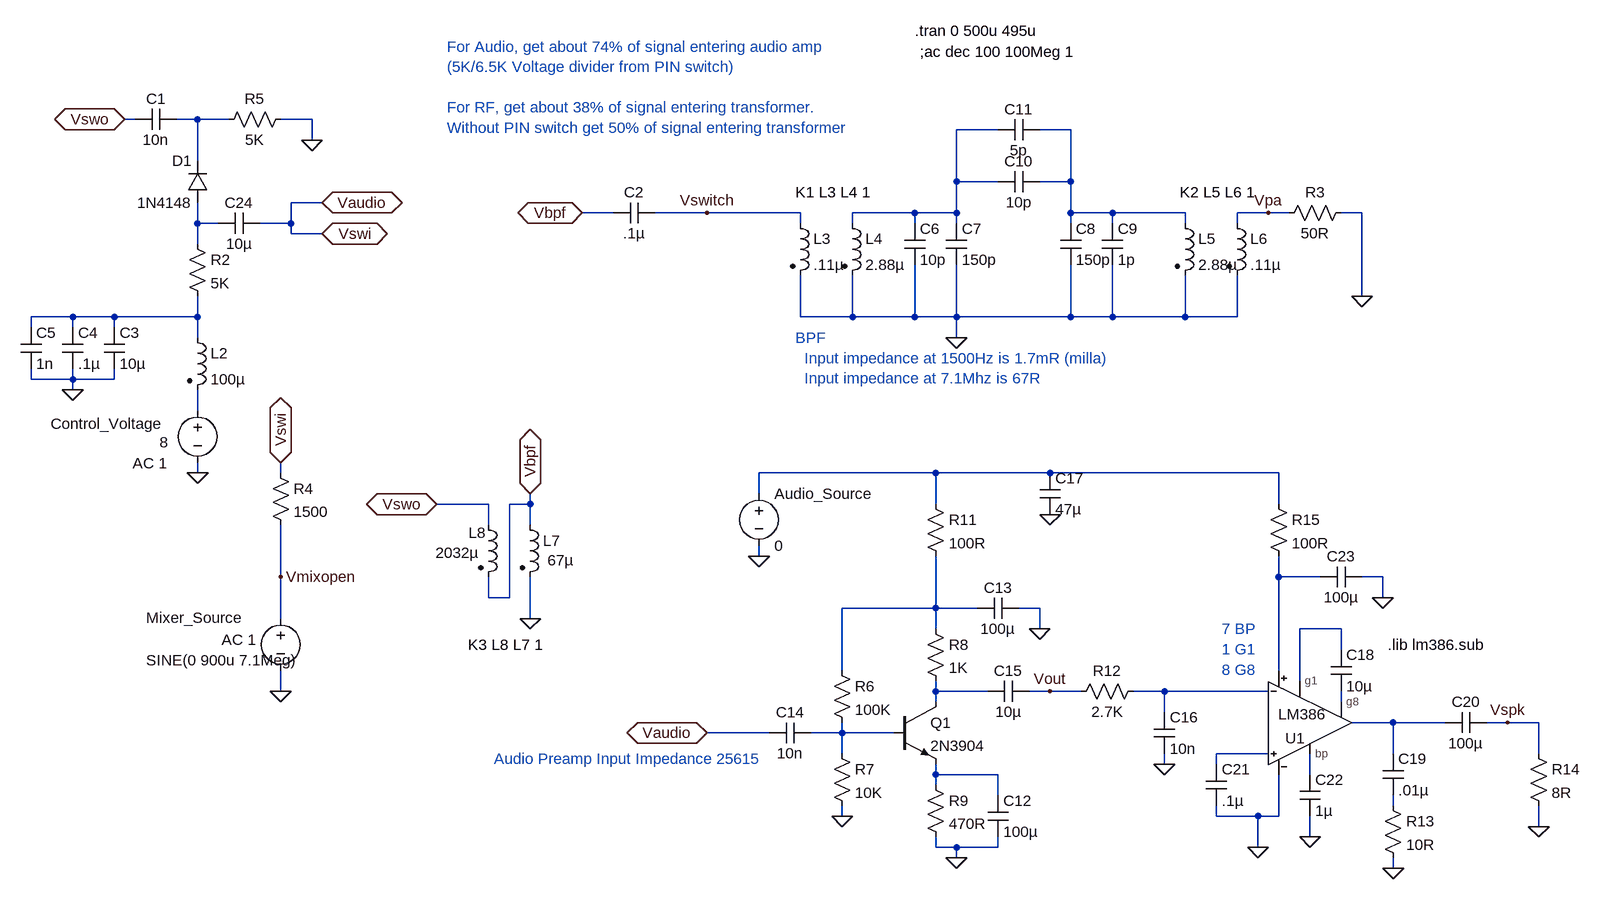
[diagram p0: schematic Transmit Chain Diode Switch Test.asc]
Transmit Chain Diode Switch Test.asc, the LTspice schematic file:
Version 4
SHEET 1 2548 1236
WIRE -512 64 -528 64
WIRE -416 64 -448 64
WIRE -368 64 -416 64
WIRE -240 64 -288 64
WIRE 816 80 752 80
WIRE 928 80 880 80
WIRE -240 96 -240 64
WIRE -416 128 -416 64
WIRE 752 160 752 80
WIRE 816 160 752 160
WIRE 928 160 928 80
WIRE 928 160 880 160
WIRE -224 192 -272 192
WIRE 224 208 176 208
WIRE 368 208 288 208
WIRE 512 208 368 208
WIRE 688 208 592 208
WIRE 752 208 752 160
WIRE 752 208 688 208
WIRE 928 208 928 160
WIRE 992 208 928 208
WIRE 1104 208 992 208
WIRE 1232 208 1184 208
WIRE 1264 208 1232 208
WIRE 1376 208 1344 208
WIRE -416 224 -416 192
WIRE -384 224 -416 224
WIRE -272 224 -272 192
WIRE -272 224 -320 224
WIRE 512 224 512 208
WIRE 592 224 592 208
WIRE 688 224 688 208
WIRE 752 224 752 208
WIRE 928 224 928 208
WIRE 992 224 992 208
WIRE 1104 224 1104 208
WIRE 1184 224 1184 208
WIRE -272 240 -272 224
WIRE -224 240 -272 240
WIRE -416 256 -416 224
WIRE 1376 336 1376 208
WIRE -608 368 -672 368
WIRE -544 368 -608 368
WIRE -416 368 -416 336
WIRE -416 368 -544 368
WIRE 512 368 512 304
WIRE 592 368 592 304
WIRE 592 368 512 368
WIRE 688 368 688 288
WIRE 688 368 592 368
WIRE 752 368 752 288
WIRE 752 368 688 368
WIRE 928 368 928 288
WIRE 928 368 752 368
WIRE 992 368 992 288
WIRE 992 368 928 368
WIRE 1104 368 1104 304
WIRE 1104 368 992 368
WIRE 1184 368 1184 304
WIRE 1184 368 1104 368
WIRE -672 384 -672 368
WIRE -608 384 -608 368
WIRE -544 384 -544 368
WIRE -416 400 -416 368
WIRE 752 400 752 368
WIRE -672 464 -672 448
WIRE -608 464 -608 448
WIRE -608 464 -672 464
WIRE -544 464 -544 448
WIRE -544 464 -608 464
WIRE -608 480 -608 464
WIRE -416 512 -416 480
WIRE -416 608 -416 592
WIRE -288 608 -288 592
WIRE 720 608 448 608
WIRE 896 608 720 608
WIRE 1248 608 896 608
WIRE 896 624 896 608
WIRE 448 640 448 608
WIRE 32 656 -48 656
WIRE 96 656 96 640
WIRE 96 656 64 656
WIRE 720 656 720 608
WIRE 1248 656 1248 608
WIRE 32 688 32 656
WIRE 96 688 96 656
WIRE 448 736 448 720
WIRE -288 768 -288 688
WIRE 1248 768 1248 736
WIRE 1312 768 1248 768
WIRE 1408 768 1376 768
WIRE 32 800 32 768
WIRE 64 800 64 656
WIRE 64 800 32 800
WIRE 1408 800 1408 768
WIRE 720 816 720 736
WIRE 720 816 576 816
WIRE 784 816 720 816
WIRE 880 816 848 816
WIRE -288 832 -288 768
WIRE 96 832 96 768
WIRE 720 848 720 816
WIRE 880 848 880 816
WIRE 1344 848 1280 848
WIRE 1344 880 1344 848
WIRE 576 912 576 816
WIRE 1248 912 1248 768
WIRE 1280 928 1280 848
WIRE -288 944 -288 912
WIRE 720 944 720 928
WIRE 800 944 720 944
WIRE 896 944 864 944
WIRE 944 944 896 944
WIRE 1072 944 1024 944
WIRE 1232 944 1072 944
WIRE 720 960 720 944
WIRE 1344 960 1344 944
WIRE 1072 976 1072 944
WIRE 1424 992 1360 992
WIRE 1504 992 1424 992
WIRE 1600 992 1568 992
WIRE 1648 992 1600 992
WIRE 464 1008 368 1008
WIRE 576 1008 576 992
WIRE 576 1008 528 1008
WIRE 656 1008 576 1008
WIRE 576 1040 576 1008
WIRE 1232 1040 1152 1040
WIRE 1424 1040 1424 992
WIRE 1648 1040 1648 992
WIRE 1072 1056 1072 1040
WIRE 1152 1056 1152 1040
WIRE 720 1072 720 1056
WIRE 816 1072 720 1072
WIRE 1296 1072 1296 1040
WIRE 720 1088 720 1072
WIRE 816 1104 816 1072
WIRE 1424 1120 1424 1104
WIRE 576 1136 576 1120
WIRE 1152 1136 1152 1120
WIRE 1216 1136 1152 1136
WIRE 1248 1136 1248 1072
WIRE 1248 1136 1216 1136
WIRE 1648 1152 1648 1120
WIRE 1296 1168 1296 1136
WIRE 720 1184 720 1168
WIRE 752 1184 720 1184
WIRE 816 1184 816 1168
WIRE 816 1184 752 1184
WIRE 1216 1184 1216 1136
WIRE 752 1200 752 1184
WIRE 1424 1216 1424 1200
FLAG -416 608 0
FLAG 1376 336 0
FLAG 96 640 Vbpf
IOPIN 96 640 BiDir
FLAG -240 96 0
FLAG -608 480 0
FLAG 1232 208 Vpa
FLAG 752 400 0
FLAG 448 736 0
FLAG 576 1136 0
FLAG 752 1200 0
FLAG 880 848 0
FLAG 896 944 Vout
FLAG 1072 1056 0
FLAG 896 672 0
FLAG 1216 1184 0
FLAG 1424 1216 0
FLAG 1648 1152 0
FLAG 1600 992 Vspk
FLAG 1296 1168 0
FLAG 1408 800 0
FLAG -288 944 0
FLAG 368 208 Vswitch
FLAG 176 208 Vbpf
IOPIN 176 208 BiDir
FLAG 368 1008 Vaudio
IOPIN 368 1008 BiDir
FLAG -288 768 Vmixopen
FLAG 96 832 0
FLAG -224 192 Vaudio
IOPIN -224 192 BiDir
FLAG -288 592 Vswi
IOPIN -288 592 BiDir
FLAG -224 240 Vswi
IOPIN -224 240 BiDir
FLAG -48 656 Vswo
IOPIN -48 656 BiDir
FLAG -528 64 Vswo
IOPIN -528 64 BiDir
SYMBOL voltage -416 496 R0
WINDOW 123 -100 97 Left 2
WINDOW 39 0 0 Left 2
WINDOW 0 -226 36 Left 2
WINDOW 3 -58 65 Left 2
SYMATTR Value2 AC 1
SYMATTR InstName Control_Voltage
SYMATTR Value 8
SYMBOL cap 288 192 R90
WINDOW 0 0 32 VBottom 2
WINDOW 3 32 32 VTop 2
SYMATTR InstName C2
SYMATTR Value .1µ
SYMBOL diode -400 192 R180
WINDOW 0 24 64 Left 2
WINDOW 3 24 0 Left 2
SYMATTR InstName D1
SYMATTR Value 1N4148
SYMBOL ind2 -432 384 R0
SYMATTR InstName L2
SYMATTR Value 100µ
SYMATTR Type ind
SYMBOL res -432 240 R0
SYMATTR InstName R2
SYMATTR Value 5K
SYMBOL cap -560 384 R0
SYMATTR InstName C3
SYMATTR Value 10µ
SYMBOL cap -624 384 R0
SYMATTR InstName C4
SYMATTR Value .1µ
SYMBOL cap -688 384 R0
SYMATTR InstName C5
SYMATTR Value 1n
SYMBOL cap 672 224 R0
SYMATTR InstName C6
SYMATTR Value 10p
SYMBOL cap 736 224 R0
SYMATTR InstName C7
SYMATTR Value 150p
SYMBOL cap 912 224 R0
SYMATTR InstName C8
SYMATTR Value 150p
SYMBOL cap 976 224 R0
SYMATTR InstName C9
SYMATTR Value 1p
SYMBOL cap 880 144 R90
WINDOW 0 0 32 VBottom 2
WINDOW 3 32 32 VTop 2
SYMATTR InstName C10
SYMATTR Value 10p
SYMBOL cap 880 64 R90
WINDOW 0 0 32 VBottom 2
WINDOW 3 32 32 VTop 2
SYMATTR InstName C11
SYMATTR Value 5p
SYMBOL ind2 496 208 R0
SYMATTR InstName L3
SYMATTR Value .11µ
SYMATTR Type ind
SYMBOL ind2 576 208 R0
SYMATTR InstName L4
SYMATTR Value 2.88µ
SYMATTR Type ind
SYMBOL ind2 1088 208 R0
SYMATTR InstName L5
SYMATTR Value 2.88µ
SYMATTR Type ind
SYMBOL ind2 1168 208 R0
SYMATTR InstName L6
SYMATTR Value .11µ
SYMATTR Type ind
SYMBOL res 1360 192 R90
WINDOW 0 0 56 VBottom 2
WINDOW 3 32 56 VTop 2
SYMATTR InstName R3
SYMATTR Value 50R
SYMBOL res -272 48 R90
WINDOW 0 0 56 VBottom 2
WINDOW 3 32 56 VTop 2
SYMATTR InstName R5
SYMATTR Value 5K
SYMBOL npn 656 960 R0
SYMATTR InstName Q1
SYMATTR Value 2N3904
SYMBOL res 560 896 R0
SYMATTR InstName R6
SYMATTR Value 100K
SYMBOL res 560 1024 R0
SYMATTR InstName R7
SYMATTR Value 10K
SYMBOL res 704 832 R0
SYMATTR InstName R8
SYMATTR Value 1K
SYMBOL res 704 1072 R0
SYMATTR InstName R9
SYMATTR Value 470R
SYMBOL cap 800 1104 R0
SYMATTR InstName C12
SYMATTR Value 100µ
SYMBOL cap 848 800 R90
WINDOW 0 0 32 VBottom 2
WINDOW 3 32 32 VTop 2
SYMATTR InstName C13
SYMATTR Value 100µ
SYMBOL cap 528 992 R90
WINDOW 0 0 32 VBottom 2
WINDOW 3 32 32 VTop 2
SYMATTR InstName C14
SYMATTR Value 10n
SYMBOL voltage 448 624 R0
WINDOW 123 0 0 Left 2
WINDOW 39 0 0 Left 2
SYMATTR InstName Audio_Source
SYMATTR Value 0
SYMBOL res 704 640 R0
SYMATTR InstName R11
SYMATTR Value 100R
SYMBOL cap 864 928 R90
WINDOW 0 0 32 VBottom 2
WINDOW 3 32 32 VTop 2
SYMATTR InstName C15
SYMATTR Value 10µ
SYMBOL LM386 1296 992 R0
WINDOW 3 -49 -13 Left 2
WINDOW 0 -38 24 Left 2
SYMATTR InstName U1
SYMBOL cap 1056 976 R0
SYMATTR InstName C16
SYMATTR Value 10n
SYMBOL cap 880 608 R0
SYMATTR InstName C17
SYMATTR Value 47µ
SYMBOL cap 1328 880 R0
SYMATTR InstName C18
SYMATTR Value 10µ
SYMBOL res 1040 928 R90
WINDOW 0 0 56 VBottom 2
WINDOW 3 32 56 VTop 2
SYMATTR InstName R12
SYMATTR Value 2.7K
SYMBOL cap 1408 1040 R0
SYMATTR InstName C19
SYMATTR Value .01µ
SYMBOL res 1408 1104 R0
SYMATTR InstName R13
SYMATTR Value 10R
SYMBOL cap 1568 976 R90
WINDOW 0 0 32 VBottom 2
WINDOW 3 32 32 VTop 2
SYMATTR InstName C20
SYMATTR Value 100µ
SYMBOL res 1632 1024 R0
SYMATTR InstName R14
SYMATTR Value 8R
SYMBOL cap 1136 1056 R0
SYMATTR InstName C21
SYMATTR Value .1µ
SYMBOL cap 1280 1072 R0
SYMATTR InstName C22
SYMATTR Value 1µ
SYMBOL cap 1376 752 R90
WINDOW 0 0 32 VBottom 2
WINDOW 3 32 32 VTop 2
SYMATTR InstName C23
SYMATTR Value 100µ
SYMBOL res 1232 640 R0
SYMATTR InstName R15
SYMATTR Value 100R
SYMBOL voltage -288 816 R0
WINDOW 3 -207 80 Left 2
WINDOW 123 -91 49 Left 2
WINDOW 39 0 0 Left 2
WINDOW 0 -207 15 Left 2
SYMATTR Value SINE(0 900u 7.1Meg)
SYMATTR Value2 AC 1
SYMATTR InstName Mixer_Source
SYMBOL res -304 592 R0
SYMATTR InstName R4
SYMATTR Value 1500
SYMBOL ind2 16 672 R0
WINDOW 0 -15 28 Left 2
WINDOW 3 -66 59 Left 2
SYMATTR InstName L8
SYMATTR Value 2032µ
SYMATTR Type ind
SYMBOL ind2 80 672 R0
WINDOW 3 43 70 Left 2
SYMATTR Value 67µ
SYMATTR InstName L7
SYMATTR Type ind
SYMBOL cap -448 48 R90
WINDOW 0 0 32 VBottom 2
WINDOW 3 32 32 VTop 2
SYMATTR InstName C1
SYMATTR Value 10n
SYMBOL cap -320 208 R90
WINDOW 0 0 32 VBottom 2
WINDOW 3 32 32 VTop 2
SYMATTR InstName C24
SYMATTR Value 10µ
TEXT 40 1048 Left 2 ;Audio Preamp Input Impedance 25615
TEXT 688 -72 Left 2 !.tran 0 500u 495u
TEXT 696 -40 Left 2 !;ac dec 100 100Meg 1
TEXT 504 176 Left 2 !K1 L3 L4 1
TEXT 1096 176 Left 2 !K2 L5 L6 1
TEXT 504 400 Left 2 ;BPF\n  Input impedance at 1500Hz is 1.7mR (milla)\n  Input impedance at 7.1Mhz is 67R
TEXT 1416 872 Left 2 !.lib lm386.sub
TEXT 1160 848 Left 2 ;7 BP\n1 G1\n8 G8
TEXT 0 872 Left 2 !K3 L8 L7 1
TEXT -32 -48 Left 2 ;For Audio, get about 74% of signal entering audio amp \n(5K/6.5K Voltage divider from PIN switch)\n \nFor RF, get about 38% of signal entering transformer.  \nWithout PIN switch get 50% of signal entering transformer

The netlist it stands for:
* Transmit Chain Diode Switch Test.asc
V§Control_Voltage N006 0 8 AC 1
C2 Vswitch Vbpf .1µ
D1 N004 N001 1N4148
L2 N005 N006 100µ
R2 N004 N005 5K
C3 N005 0 10µ
C4 N005 0 .1µ
C5 N005 0 1n
C6 N002 0 10p
C7 N002 0 150p
C8 N003 0 150p
C9 N003 0 1p
C10 N003 N002 10p
C11 N003 N002 5p
L3 Vswitch 0 .11µ
L4 N002 0 2.88µ
L5 N003 0 2.88µ
L6 Vpa 0 .11µ
R3 0 Vpa 50R
R5 0 N001 5K
Q1 N011 N015 N017 0 2N3904
R6 N009 N015 100K
R7 N015 0 10K
R8 N009 N011 1K
R9 N017 0 470R
C12 N017 0 100µ
C13 0 N009 100µ
C14 N015 Vswi 10n
V§Audio_Source N007 0 0
R11 N007 N009 100R
C15 Vout N011 10µ
XU1 N010 N012 N016 0 N014 N008 N018 N013 LM386 LM386  ; pins g1 In- In+ V- OUT V+ bp g8
C16 N012 0 10n
C17 N007 0 47µ
C18 N010 N013 10µ
R12 N012 Vout 2.7K
C19 N014 N019 .01µ
R13 N019 0 10R
C20 Vspk N014 100µ
R14 Vspk 0 8R
C21 N016 0 .1µ
C22 N018 0 1µ
C23 0 N008 100µ
R15 N007 N008 100R
V§Mixer_Source Vmixopen 0 SINE(0 900u 7.1Meg) AC 1
R4 Vswi Vmixopen 1500
L8 Vswo Vbpf 2032µ
L7 Vbpf 0 67µ
C1 N001 Vswo 10n
C24 Vswi N004 10µ
.model D D
.lib standard.dio
.model NPN NPN
.model PNP PNP
.lib standard.bjt
* Audio Preamp Input Impedance 25615
.tran 0 500u 495u
;ac dec 100 100Meg 1
K1 L3 L4 1
K2 L5 L6 1
* BPF
*   Input impedance at 1500Hz is 1.7mR (milla)
*   Input impedance at 7.1Mhz is 67R
.lib lm386.sub
* 7 BP
* 1 G1
* 8 G8
K3 L8 L7 1
* For Audio, get about 74% of signal entering audio amp
* (5K/6.5K Voltage divider from PIN switch)
* For RF, get about 38% of signal entering transformer.
* Without PIN switch get 50% of signal entering transformer
.lib LM386.sub
.backanno
.end